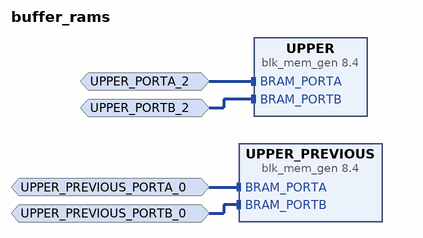
[diagram p0: block diagram of the top level]
# Vivado block design buffer_rams, xc7z020clg400-1, Vivado 2022.2
create_bd_design buffer_rams

create_bd_intf_port -mode Slave -vlnv xilinx.com:interface:bram_rtl:1.0 UPPER_PREVIOUS_PORTA_0
create_bd_intf_port -mode Slave -vlnv xilinx.com:interface:bram_rtl:1.0 UPPER_PREVIOUS_PORTB_0
create_bd_intf_port -mode Slave -vlnv xilinx.com:interface:bram_rtl:1.0 UPPER_PORTA_2
create_bd_intf_port -mode Slave -vlnv xilinx.com:interface:bram_rtl:1.0 UPPER_PORTB_2

create_bd_cell -type ip -vlnv xilinx.com:ip:blk_mem_gen:8.4 UPPER_PREVIOUS
set_property -dict [list \
  CONFIG.Memory_Type Simple_Dual_Port_RAM \
  CONFIG.Write_Depth_A 330 \
  CONFIG.Write_Width_A 128 \
  CONFIG.use_bram_block Stand_Alone \
] [get_bd_cells UPPER_PREVIOUS]
create_bd_cell -type ip -vlnv xilinx.com:ip:blk_mem_gen:8.4 UPPER
set_property -dict [list \
  CONFIG.Memory_Type Simple_Dual_Port_RAM \
  CONFIG.Write_Depth_A 330 \
  CONFIG.Write_Width_A 128 \
  CONFIG.use_bram_block Stand_Alone \
] [get_bd_cells UPPER]

# ---- connections ----

connect_bd_intf_net -intf_net BRAM_PORTA_0_1 [get_bd_intf_ports UPPER_PREVIOUS_PORTA_0] [get_bd_intf_pins UPPER_PREVIOUS/BRAM_PORTA]
connect_bd_intf_net -intf_net BRAM_PORTA_2_1 [get_bd_intf_ports UPPER_PORTA_2] [get_bd_intf_pins UPPER/BRAM_PORTA]
connect_bd_intf_net -intf_net BRAM_PORTB_0_1 [get_bd_intf_ports UPPER_PREVIOUS_PORTB_0] [get_bd_intf_pins UPPER_PREVIOUS/BRAM_PORTB]
connect_bd_intf_net -intf_net BRAM_PORTB_2_1 [get_bd_intf_ports UPPER_PORTB_2] [get_bd_intf_pins UPPER/BRAM_PORTB]

validate_bd_design
save_bd_design
